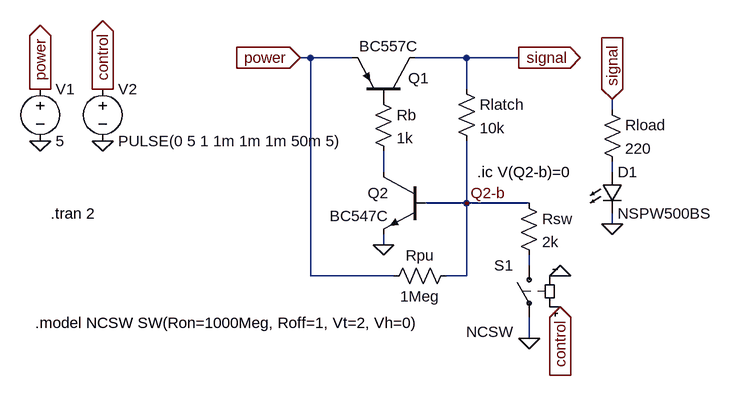
[diagram p0: schematic latch-npn-pnp-nc.asc]
latch-npn-pnp-nc.asc, the LTspice schematic file:
Version 4
SHEET 1 1184 680
WIRE 400 112 384 112
WIRE 464 112 400 112
WIRE 640 112 560 112
WIRE 720 112 640 112
WIRE 640 160 640 112
WIRE 864 192 864 176
WIRE 512 288 512 256
WIRE 864 288 864 272
WIRE 640 336 640 240
WIRE 640 336 576 336
WIRE 736 336 640 336
WIRE 864 368 864 352
WIRE 512 400 512 384
WIRE 736 432 736 416
WIRE 400 448 400 112
WIRE 528 448 400 448
WIRE 640 448 640 336
WIRE 640 448 608 448
WIRE 736 544 736 512
FLAG 512 400 0
FLAG 384 112 power
IOPIN 384 112 In
FLAG 720 112 signal
IOPIN 720 112 Out
FLAG 864 368 0
FLAG 864 176 signal
IOPIN 864 176 In
FLAG -16 240 0
FLAG -16 160 power
IOPIN -16 160 Out
FLAG 80 240 0
FLAG 80 160 control
IOPIN 80 160 Out
FLAG 784 496 control
IOPIN 784 496 In
FLAG 784 448 0
FLAG 640 336 Q2-b
FLAG 736 544 0
SYMBOL pnp 560 176 M270
WINDOW 0 33 10 VLeft 2
WINDOW 3 82 85 VLeft 2
SYMATTR InstName Q1
SYMATTR Value BC557C
SYMBOL npn 576 288 M0
SYMATTR InstName Q2
SYMATTR Value BC547C
SYMBOL Res 624 144 R0
SYMATTR InstName Rlatch
SYMATTR Value 10k
SYMBOL Res 848 176 R0
SYMATTR InstName Rload
SYMATTR Value 220
SYMBOL Voltage -16 144 R0
SYMATTR InstName V1
SYMATTR Value 5
SYMBOL Voltage 80 144 R0
SYMATTR InstName V2
SYMATTR Value PULSE(0 5 1 1m 1m 1m 50m 5)
SYMBOL sw 736 416 M0
WINDOW 38 24 118 Left 2
WINDOW 3 24 96 Invisible 2
SYMATTR SpiceModel NCSW
SYMATTR InstName S1
SYMBOL Res 496 160 R0
SYMATTR InstName Rb
SYMATTR Value 1k
SYMBOL LED 848 288 R0
SYMATTR InstName D1
SYMATTR Value NSPW500BS
SYMATTR Description Diode
SYMATTR Type diode
SYMBOL Res 720 320 R0
SYMATTR InstName Rsw
SYMATTR Value 2k
SYMBOL Res 624 432 R90
WINDOW 0 0 56 VBottom 2
WINDOW 3 32 56 VTop 2
SYMATTR InstName Rpu
SYMATTR Value 1Meg
TEXT -24 520 Left 2 !.model NCSW SW(Ron=1000Meg, Roff=1, Vt=2, Vh=0)
TEXT 0 352 Left 2 !.tran 2
TEXT 656 288 Left 2 !.ic V(Q2-b)=0

The netlist it stands for:
* latch-npn-pnp-nc.asc
Q1 signal P001 power 0 BC557C
Q2 N001 Q2-b 0 0 BC547C
Rlatch signal Q2-b 10k
Rload signal N002 220
V1 power 0 5
V2 control 0 PULSE(0 5 1 1m 1m 1m 50m 5)
S1 N003 0 control 0 NCSW SW
Rb P001 N001 1k
D1 N002 0 NSPW500BS
Rsw Q2-b N003 2k
Rpu Q2-b power 1Meg
.model D D
.lib standard.dio
.model NPN NPN
.model PNP PNP
.lib standard.bjt
.model NCSW SW(Ron=1000Meg, Roff=1, Vt=2, Vh=0)
.tran 2
.ic V(Q2-b)=0
.backanno
.end